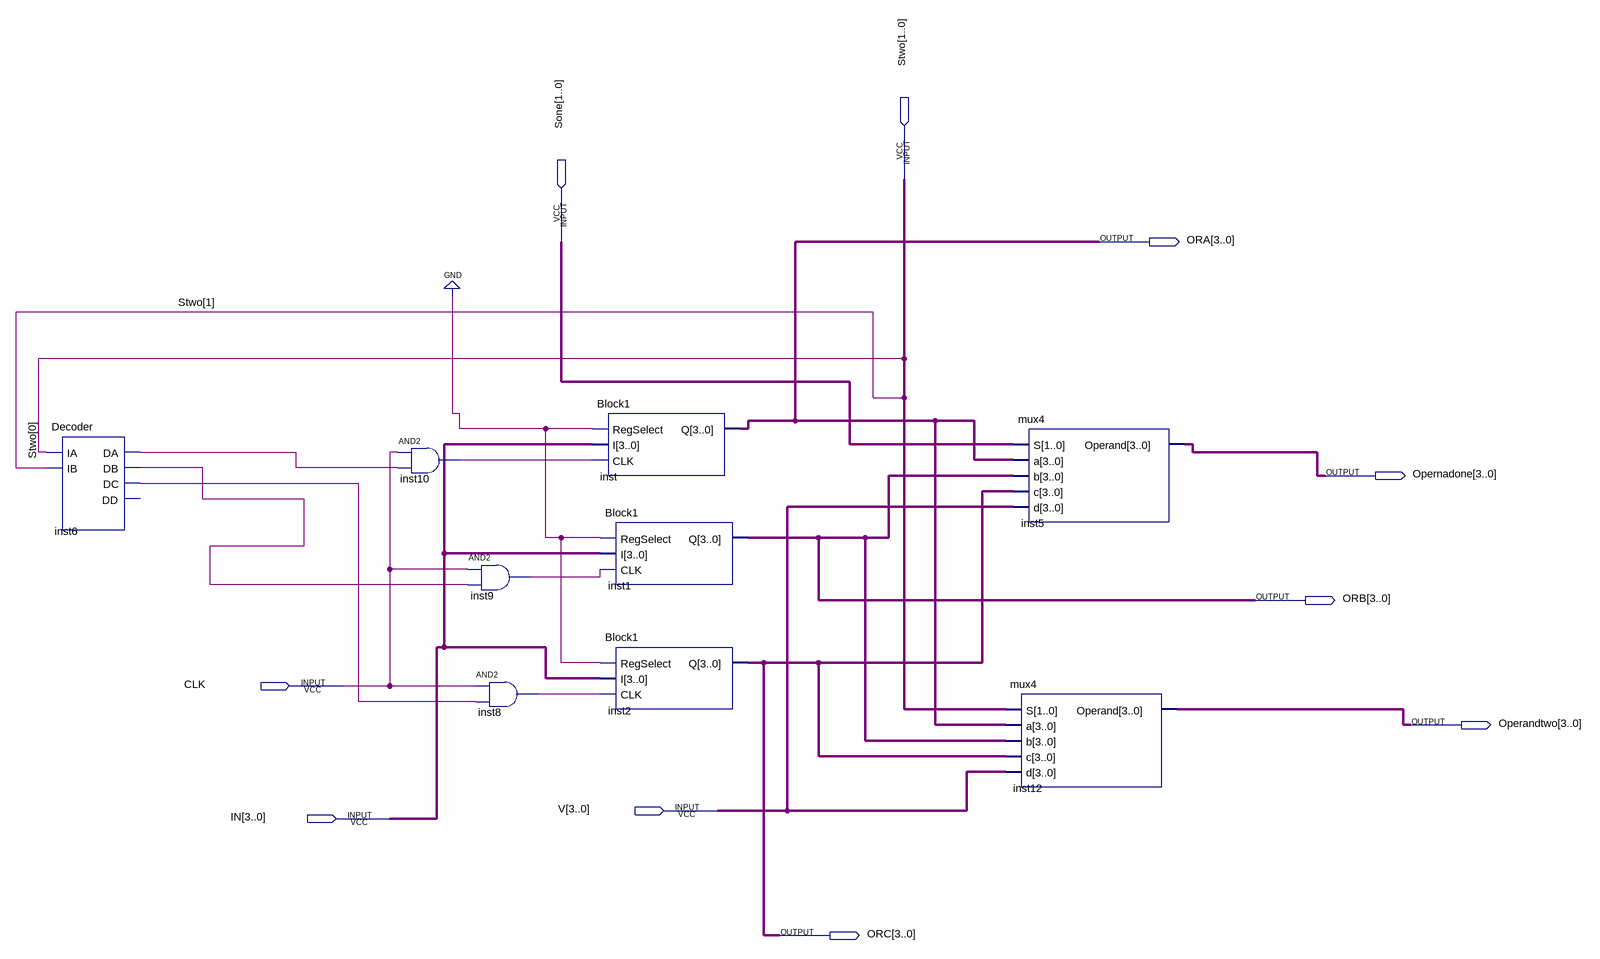
[diagram p0: schematic sheet]
// Quartus schematic Block2a.bdf as structural Verilog: 9 symbols, 10 pins
module Block2a (
  input  [1:0] Stwo,
  input  [1:0] Sone,
  input  CLK,
  input  [3:0] V,
  input  [3:0] IN,
  output [3:0] ORA,
  output [3:0] Opernadone,
  output [3:0] ORB,
  output [3:0] Operandtwo,
  output [3:0] ORC
);

  wire inst6_da, inst6_db, inst6_dc, inst8_out, inst9_out, inst10_out;

  Decoder inst6 (.IA(Stwo[0]), .IB(Stwo[1]), .DA(inst6_da), .DB(inst6_db), .DC(inst6_dc));  // open: DD
  and inst10 (inst10_out, CLK, inst6_da);
  and inst9 (inst9_out, CLK, inst6_db);
  and inst8 (inst8_out, CLK, inst6_dc);
  Block1 inst (.RegSelect(1'b0), .I(IN), .CLK(inst10_out), .Q(ORA));
  Block1 inst1 (.RegSelect(1'b0), .I(IN), .CLK(inst9_out), .Q(ORB));
  Block1 inst2 (.RegSelect(1'b0), .I(IN), .CLK(inst8_out), .Q(ORC));
  mux4 inst5 (.S(Sone), .a(ORA), .b(ORB), .c(ORC), .d(V), .Operand(Opernadone));
  mux4 inst12 (.S(Stwo), .a(ORA), .b(ORB), .c(ORC), .d(V), .Operand(Operandtwo));
endmodule
